# Altium schematic sheet Supply_for_adums.SchDoc
size A4
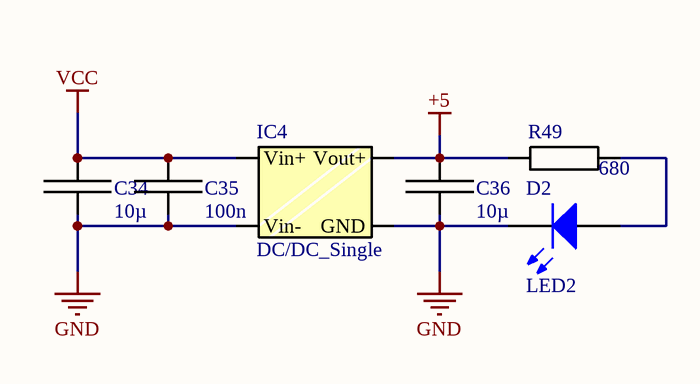
[diagram p0: Supply_for_adums.SchDoc]

## Parts
C34  10µ  [RLC_0805]
C35  100n  [RLC_0805]
C36  10µ  [RLC_0805]
D2  LED2  [3.2X1.6X1.1]
IC4  DC/DC_Single  [SIP4DCDC]
R49  680  [RLC_0805]

## Nets
+5: C36.1 IC4.6(Vout+) R49.1
GND: C34.2 C35.2 C36.2 D2.2(K) IC4.2(Vin-) IC4.4(GND)
VCC: C34.1 C35.1 IC4.1(Vin+)
NetD2_1: D2.1(A) R49.2

## Library data of the parts
C34-C36 = C
D2 = LED2: Typical RED, GREEN, YELLOW, AMBER GaAs LED; Published: 8-Jun-2000; LatestRevisionDate: 17-Jul-2002; LatestRevisionNote: Re-released for DXP Platform.; PackageVersion: Feb-2002; PackageReference: 3.2X1.6X1.1; Publisher: Altium Limited; PackageDescription: SM LED; 2 Flat Leads
IC4 = DC/DC_Single: pin to pad: 1>2 2>1 4>3 6>4
R49 = R